# Altium schematic sheet SCH-11-Out Going Connectors.SchDoc
size A
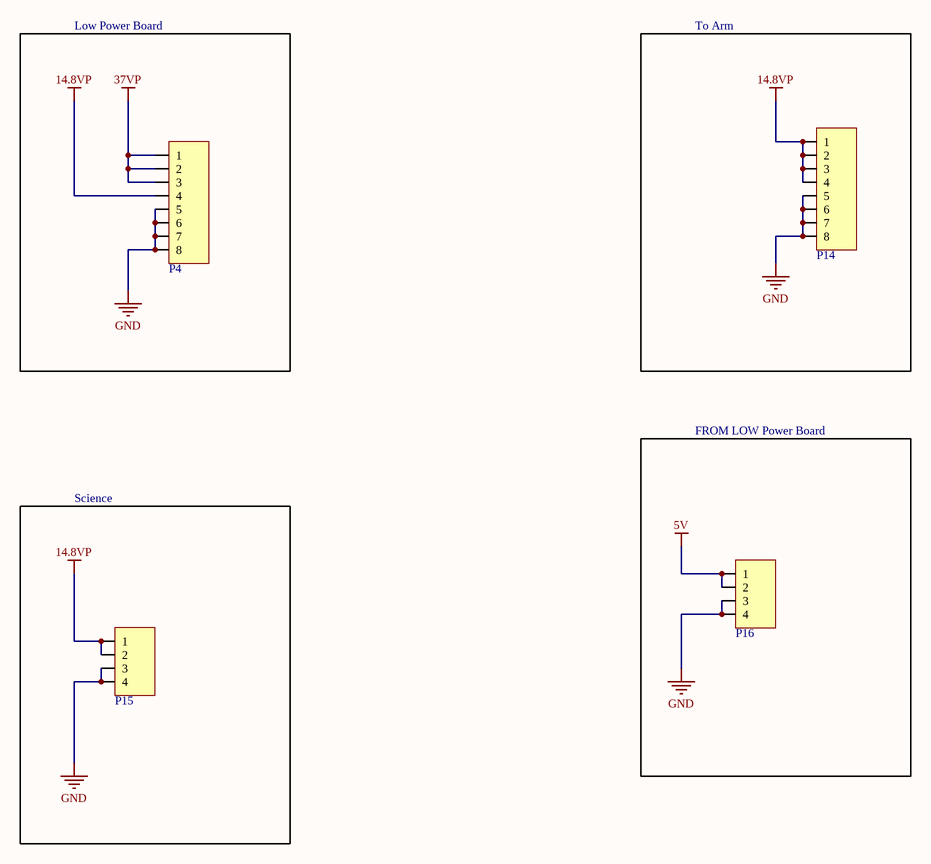
[diagram p0: SCH-11-Out Going Connectors.SchDoc]

## Parts
P4  Mini-Fit Jr 8 Pos  [Molex Mini-Fit Jr 0039281083]  (value not drawn)
P14  Mini-Fit Jr 8 Pos RA  [MOLEX 172065-0208]  (value not drawn)
P15  Mini-Fit Jr 4 Pos  [MOLEX 0039281043]  (value not drawn)
P16  Mini-Fit Jr 4 Pos  [MOLEX 0039281043]  (value not drawn)

## Blocks framed on the sheet
Low Power Board: P4
To Arm: P14
FROM LOW Power Board: P16
Science: P15

## Nets
5V: P16.1 P16.2
14.8VP: P4.4 P14.1 P14.2 P14.3 P14.4 P15.1 P15.2
37VP: P4.1 P4.2 P4.3
GND: P4.5 P4.6 P4.7 P4.8 P14.5 P14.6 P14.7 P14.8 P15.3 P15.4 P16.3 P16.4

## Library data of the parts
P4 = Molex Mini-Fit Jr 8pos Vert
P14 = Molex Mega-Fit 8pos Vert
P15 P16 = Molex 0039281043: Mini-Fit Jr. Header, Dual Row, Right-Angle, with Snap-in Plastic Peg PCB Lock, 6 Circuits, PA Polyamide Nylon 6/6 94V-2, 0.76µm Select Gold (Au) Plating